# Altium project 计算机原理课程设计.PrjPcb
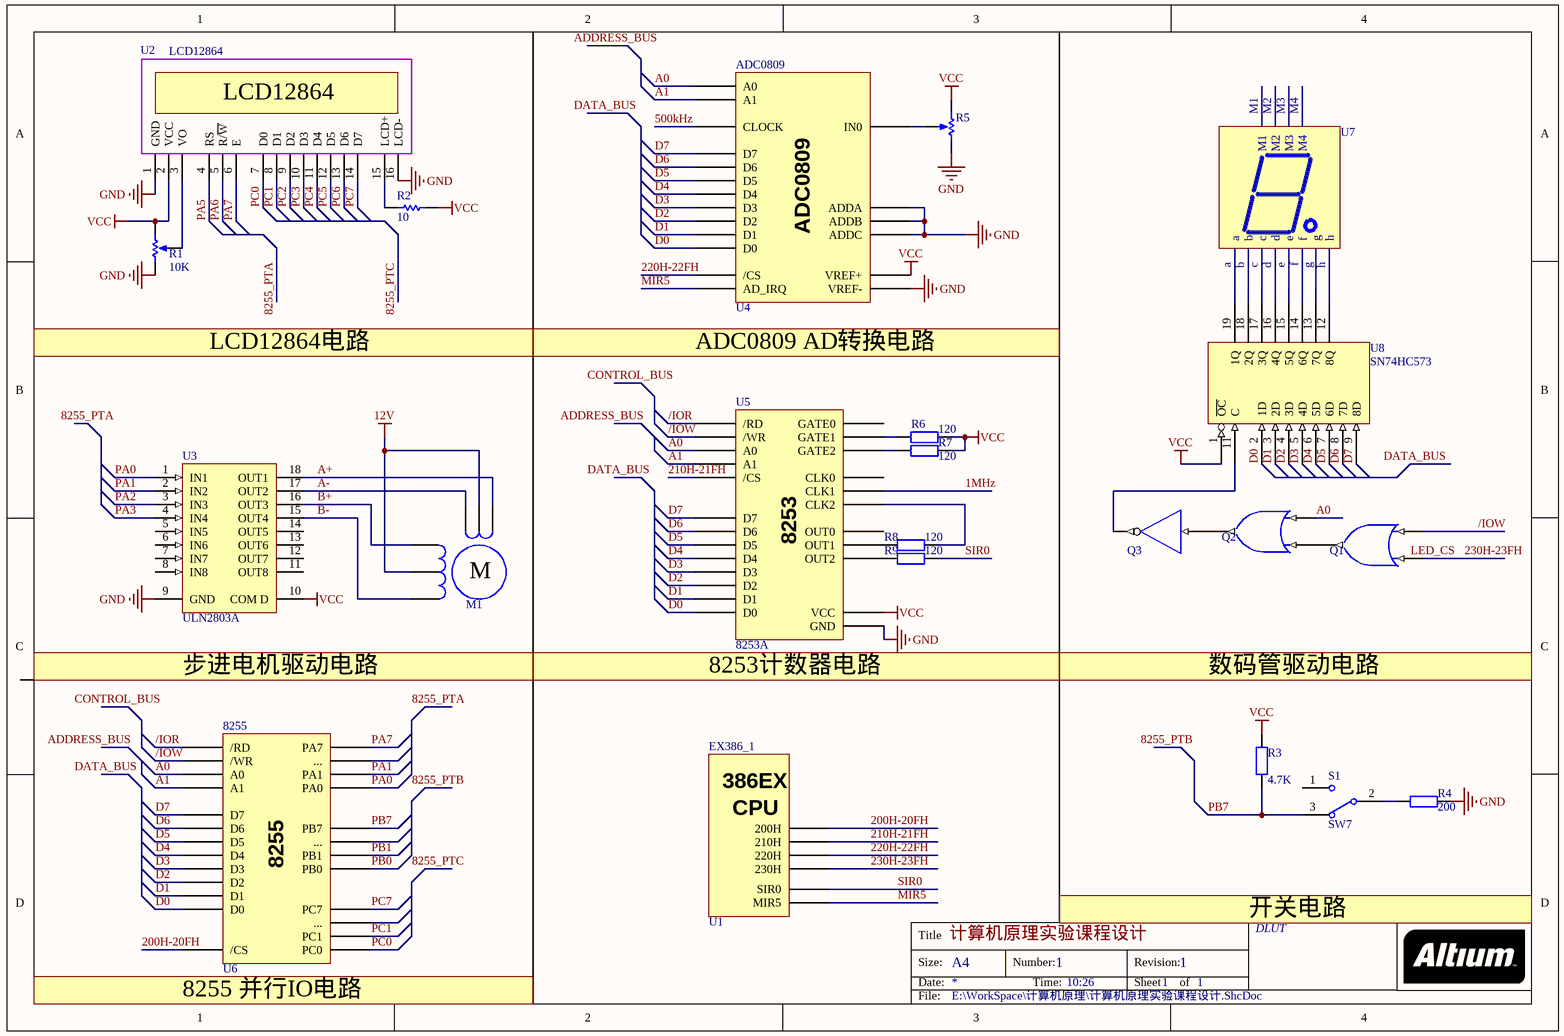
[diagram p0: 计算机原理课程设计.SchDoc]
1 sheet, 22 parts. Net scope: global (net labels, ports and power ports of the same name join across sheets).

## Sheet 计算机原理课程设计.SchDoc: 计算机原理实验课程设计
size A4; Date: 2017/12/25; Organization: DLUT; DocumentNumber: 1; Revision: 1; SheetNumber: 1; SheetTotal: 1; CurrentTime: 10:26; DocumentFullPathAndName: E:\WorkSpace\计算机原理\计算机原理实验课程设计.ShcDoc; DocumentName: 计算机原理实验课程设计.ShcDoc

### Parts
8255  U6
ADC0809  U4
EX386_1  U1
M1  MOTOR STEPPER  (value not drawn)
Q1  OR  (value not drawn)
Q2  OR  (value not drawn)
Q3  NOT  (value not drawn)
R1  value 10K  [VR5]  (hidden comment: RPot)
R2  value 10  [AXIAL-0.3]  (hidden comment: Res1)
R3  value 4.7K  [AXIAL-0.4]  (hidden comment: Res2)
R4  value 200  [AXIAL-0.4]  (hidden comment: Res2)
R5  RPot  [VR5]  (value not drawn)
R6  value 120  [AXIAL-0.4]  (hidden comment: Res2)
R7  value 120  [AXIAL-0.4]  (hidden comment: Res2)
R8  value 120  [AXIAL-0.4]  (hidden comment: Res2)
R9  value 120  [AXIAL-0.4]  (hidden comment: Res2)
S1  SW7  [TL36WW15050]
U2  LCD12864  [LCD1602]
U3  ULN2803A  [A18]
U5  8253A
U7  4_8SEG_LED  [4-8SLED(B)]  (value not drawn)
U8  SN74HC573  [DIP-20]

### Nets
12V: M1.2 M1.5
GND: ADC0809.GND(ADDA) R1.1(TOP) R4.1 R5.2(BOT) U2.1(GND) U2.16(LCD-) U3.9(GND) U5.GND U8.10(GND)
VCC: ADC0809.GND(VREF+) R1.2(BOT) R2.1 R3.2 R5.1(TOP) R6.2 R7.2 U2.2(VCC) U3.10(COM_D) U5.GND(VCC) U8.1(~{OC}) U8.20(VCC)
1MHz: U5.GND(CLK1)
200H-20FH: 8255.GND(/CS) EX386_1.GND(200H)
210H-21FH: EX386_1.GND(210H) U5.GND(/CS)
220H-22FH: ADC0809.GND(/CS) EX386_1.GND(220H)
230H-23FH: EX386_1.GND(230H) Q1.1(A)
500kHz: ADC0809.GND(CLOCK)
/IOR: 8255.GND(/RD) U5.GND(/RD)
/IOW: 8255.GND(/WR) Q1.2(B) U5.GND(/WR)
A0: 8255.GND(A0) ADC0809.GND(A0) Q2.2(B) U5.GND(A0)
A1: 8255.GND(A1) ADC0809.GND(A1) U5.GND(A1)
A+: M1.1 U3.18(OUT1)
A-: M1.3 U3.17(OUT2)
B+: M1.4 U3.16(OUT3)
B-: M1.6 U3.15(OUT4)
D0: 8255.GND(D0) ADC0809.GND(D0) U5.GND(D0) U8.2(1D)
D1: 8255.GND(D1) ADC0809.GND(D1) U5.GND(D1) U8.3(2D)
D2: 8255.GND(D2) ADC0809.GND(D2) U5.GND(D2) U8.4(3D)
D3: 8255.GND(D3) ADC0809.GND(D3) U5.GND(D3) U8.5(4D)
D4: 8255.GND(D4) ADC0809.GND(D4) U5.GND(D4) U8.6(5D)
D5: 8255.GND(D5) ADC0809.GND(D5) U5.GND(D5) U8.7(6D)
D6: 8255.GND(D6) ADC0809.GND(D6) U5.GND(D6) U8.8(7D)
D7: 8255.GND(D7) ADC0809.GND(D7) U5.GND(D7) U8.9(8D)
MIR5: ADC0809.GND(AD_IRQ) EX386_1.GND(MIR5)
PA0: 8255.GND(PA0) U3.1(IN1)
PA1: 8255.GND(PA1) U3.2(IN2)
PA2: U3.3(IN3)
PA3: U3.4(IN4)
PA5: U2.4(RS)
PA6: U2.5(R/~{W})
PA7: 8255.GND(PA7) U2.6(E)
PB0: 8255.GND(PB0)
PB1: 8255.GND(PB1)
PB7: 8255.GND(PB7) R3.1 S1.3
PC0: 8255.GND(PC0) U2.7(D0)
PC1: 8255.GND(PC1) U2.8(D1)
PC2: U2.9(D2)
PC3: U2.10(D3)
PC4: U2.11(D4)
PC5: U2.12(D5)
PC6: U2.13(D6)
PC7: 8255.GND(PC7) U2.14(D7)
SIR0: EX386_1.GND(SIR0) R9.2
NetADC0809_GND: ADC0809.GND(IN0) R5.3(TAP)
NetQ1_3: Q1.3(Y) Q2.1(A)
NetQ2_3: Q2.3(Y) Q3.1(A)
NetQ3_2: Q3.2(Y) U8.11(C)
NetR1_3: R1.3(TAP) U2.3(VO)
NetR2_2: R2.2 U2.15(LCD+)
NetR4_2: R4.2 S1.2
NetR6_1: R6.1 U5.GND(GATE1)
NetR7_1: R7.1 U5.GND(GATE2)
NetR8_1: R8.1 U5.GND(OUT1)
NetR8_2: R8.2 U5.GND(CLK2)
NetR9_1: R9.1 U5.GND(OUT2)
NetU7_a: U7.a U8.19(1Q)
NetU7_b: U7.b U8.18(2Q)
NetU7_c: U7.c U8.17(3Q)
NetU7_d: U7.d U8.16(4Q)
NetU7_e: U7.e U8.15(5Q)
NetU7_f: U7.f U8.14(6Q)
NetU7_g: U7.g U8.13(7Q)
NetU7_h: U7.h U8.12(8Q)

Not connected (* = marked no-connect by the designer): S1 1; U3 5(IN5) 6(IN6) 7(IN7) 8(IN8) 11(OUT8) 12(OUT7) 13(OUT6) 14(OUT5); U7 M1 M2 M3 M4

### Notes on the sheet
- (near U2) LCD12864
- LCD12864电路
- (near ADC0809) ADC0809 AD转换电路
- (near M1) M
- 步进电机驱动电路
- (near U5) 8253计数器电路
- 数码管驱动电路
- 开关电路
- (near 8255) 8255 并行IO电路
- Labels drawn without touching a wire or pin: 8255_PTA, 8255_PTB, 8255_PTC, ADDRESS_BUS, CONTROL_BUS, DATA_BUS, LED_CS
- Title
- Size:
- Date:
- A4
- Number:
- Time:
- Revision:
- Sheet
- of
- File:
- (in symbol 386EX) CPU
- (in symbol 8253A) 8253

### Library data of the parts
8255 = 8255
ADC0809 = ADC0809
EX386_1 = 386EX
Q1 Q2 = OR: OR Gate
Q3 = NOT: Inverter
R1 = RPot: Potentiometer; Sim Note: Enter the Resistance value and the set point into parameter fields.; Set Position: 0.5; Published: 8-Jun-2000; LatestRevisionDate: 17-Jul-2002; LatestRevisionNote: Re-released for DXP Platform.; PackageReference: VR5; Publisher: Altium Limited; PackageDescription: Variable Resistor, Thru-Hole; 3 Leads
R2 = Res1: Resistor; Published: 8-Jun-2000; LatestRevisionDate: 17-Jul-2002; LatestRevisionNote: Re-released for DXP Platform.; PackageReference: AXIAL-0.3; Publisher: Altium Limited; PackageDescription: Axial Device, Thru-Hole; 2 Leads; 0.3 in Pin Spacing
R3 R4 R6-R9 = Res2: Resistor; Published: 8-Jun-2000; LatestRevisionDate: 17-Jul-2002; LatestRevisionNote: Re-released for DXP Platform.; PackageReference: AXIAL-0.4; Publisher: Altium Limited; PackageDescription: Axial Device, Thru-Hole; 2 Leads; 0.4 in Pin Spacing
R5 = RPot: Potentiometer; Sim Note: Enter the Resistance value and the set point into parameter fields.; Set Position: 0.5; Value: 10K; Published: 8-Jun-2000; LatestRevisionDate: 17-Jul-2002; LatestRevisionNote: Re-released for DXP Platform.; PackageReference: VR5; Publisher: Altium Limited; PackageDescription: Variable Resistor, Thru-Hole; 3 Leads
S1 = SW-SPDT: SPDT Subminiature Toggle Switch, Right Angle Mounting, Vertical Actuation; Published: 24-Mar-1999; LatestRevisionDate: 17-Dec-2003; LatestRevisionNote: Schematic revised, PCB Footprint replaced.; DatasheetVersion: 05-Dec-2000; PackageReference: TL36WW15050; Publisher: Altium Limited; PackageDescription: Switch; 4 Leads; ComponentLink1Description: Manufacturer Link; ComponentLink1URL: http://www.apem.com
U2 = LCD1602
U3 = ULN2803A: High-Voltage, High-Current Darlington Array; Published: 13-Oct-2000; LatestRevisionDate: 06-Jun-2005; LatestRevisionNote: Stylized 3D Model Added.; DatasheetVersion: 1999; PackageVersion: 1999; PackageReference: A18; Publisher: Altium Limited; PackageDescription: DIP; 18 Leads; Row Spacing 7.62 mm; Pitch 2.54 mm; ComponentLink1Description: Manufacturer Link; ComponentLink1URL: http://www.allegromicro.com/
U8 = SN74HC573: OCTAL D-TYPE TRANSPARENT LCH 3SO